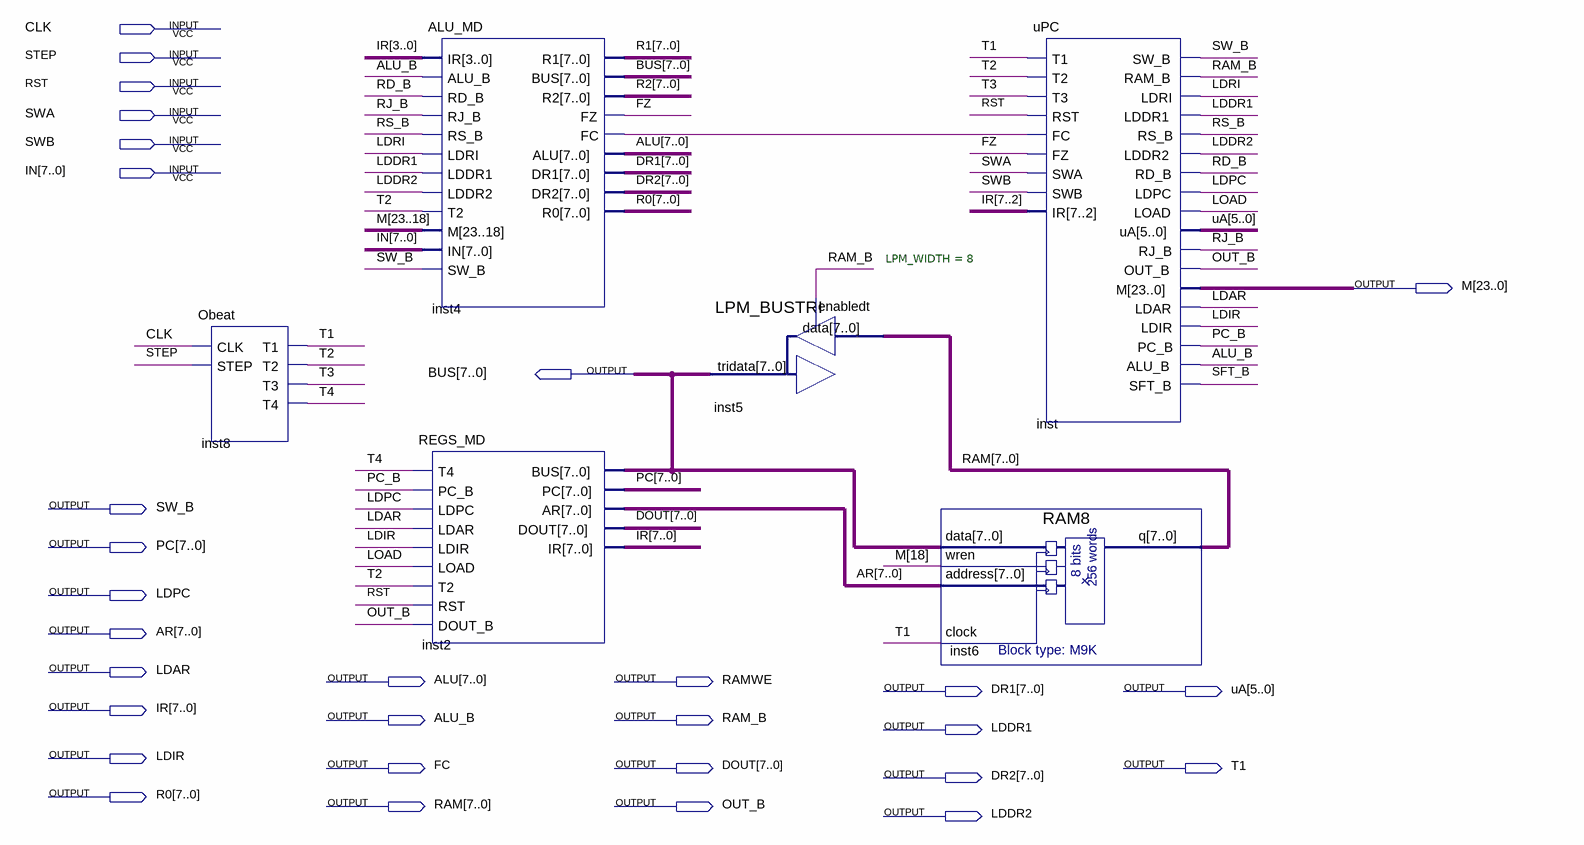
[diagram p0: schematic sheet]
// Quartus schematic A_CPU.bdf as structural Verilog: 6 symbols, 30 pins
module A_CPU (
  input  CLK,
  input  STEP,
  input  RST,
  input  SWA,
  input  SWB,
  input  [7:0] IN,
  output [23:0] M,
  output [7:0] BUS,
  output SW_B,
  output [7:0] PC,
  output LDPC,
  output [7:0] AR,
  output LDAR,
  output [7:0] ALU,
  output RAMWE,
  output [7:0] DR1,
  output [5:0] uA,
  output [7:0] IR,
  output ALU_B,
  output RAM_B,
  output LDDR1,
  output LDIR,
  output FC,
  output [7:0] DOUT,
  output T1,
  output [7:0] DR2,
  output [7:0] R0,
  output [7:0] RAM,
  output OUT_B,
  output LDDR2
);

  wire FZ, inst4_fc, LDRI, LOAD, PC_B, RD_B, RJ_B, RS_B, SFT_B, T2, T3, T4;
  wire [7:0] R1, R2;

  Obeat inst8 (.CLK(CLK), .STEP(STEP), .T1(T1), .T2(T2), .T3(T3), .T4(T4));
  ALU_MD inst4 (
    .IR(IR[3:0]), .ALU_B(ALU_B), .RD_B(RD_B), .RJ_B(RJ_B), .RS_B(RS_B), .LDRI(LDRI), .LDDR1(LDDR1),
    .LDDR2(LDDR2), .T2(T2), .M(M[23:18]), .IN(IN), .SW_B(SW_B), .R1(R1), .BUS(BUS), .R2(R2), .FZ(FZ),
    .FC(inst4_fc), .ALU(ALU), .DR1(DR1), .DR2(DR2), .R0(R0));
  REGS_MD inst2 (
    .T4(T4), .PC_B(PC_B), .LDPC(LDPC), .LDAR(LDAR), .LDIR(LDIR), .LOAD(LOAD), .T2(T2), .RST(RST),
    .DOUT_B(OUT_B), .BUS(BUS), .PC(PC), .AR(AR), .DOUT(DOUT), .IR(IR));
  LPM_BUSTRI #(.LPM_WIDTH(8)) inst5 (.data(RAM), .enabledt(RAM_B), .tridata(BUS));
  RAM8 inst6 (.data(BUS), .wren(M[18]), .address(AR), .clock(T1), .q(RAM));
  uPC inst (
    .T1(T1), .T2(T2), .T3(T3), .RST(RST), .FC(inst4_fc), .FZ(FZ), .SWA(SWA), .SWB(SWB), .IR(IR[7:2]),
    .SW_B(SW_B), .RAM_B(RAM_B), .LDRI(LDRI), .LDDR1(LDDR1), .RS_B(RS_B), .LDDR2(LDDR2), .RD_B(RD_B),
    .LDPC(LDPC), .LOAD(LOAD), .uA(uA), .RJ_B(RJ_B), .OUT_B(OUT_B), .M(M), .LDAR(LDAR), .LDIR(LDIR),
    .PC_B(PC_B), .ALU_B(ALU_B), .SFT_B(SFT_B));
endmodule
